# Altium schematic sheet Sheet1.SchDoc: Мобильное устройство обмена
size 420 x 297 mm; CheckedBy: Ролич; Author: Лёля; CompanyName: ПИКС, гр. 613802; Address1: Address1; Address2: Address2; Address3: Address3; Address4: Address4; DocumentNumber: ГУИР.465614.009 Э3; SheetNumber: 1; SheetTotal: 1; Scale: 1:1; Title2str: данными через Ethernet; DocumentType: Схема электрическая принципиальная; FirstReferrence: ГУИР.465614.009 Э3
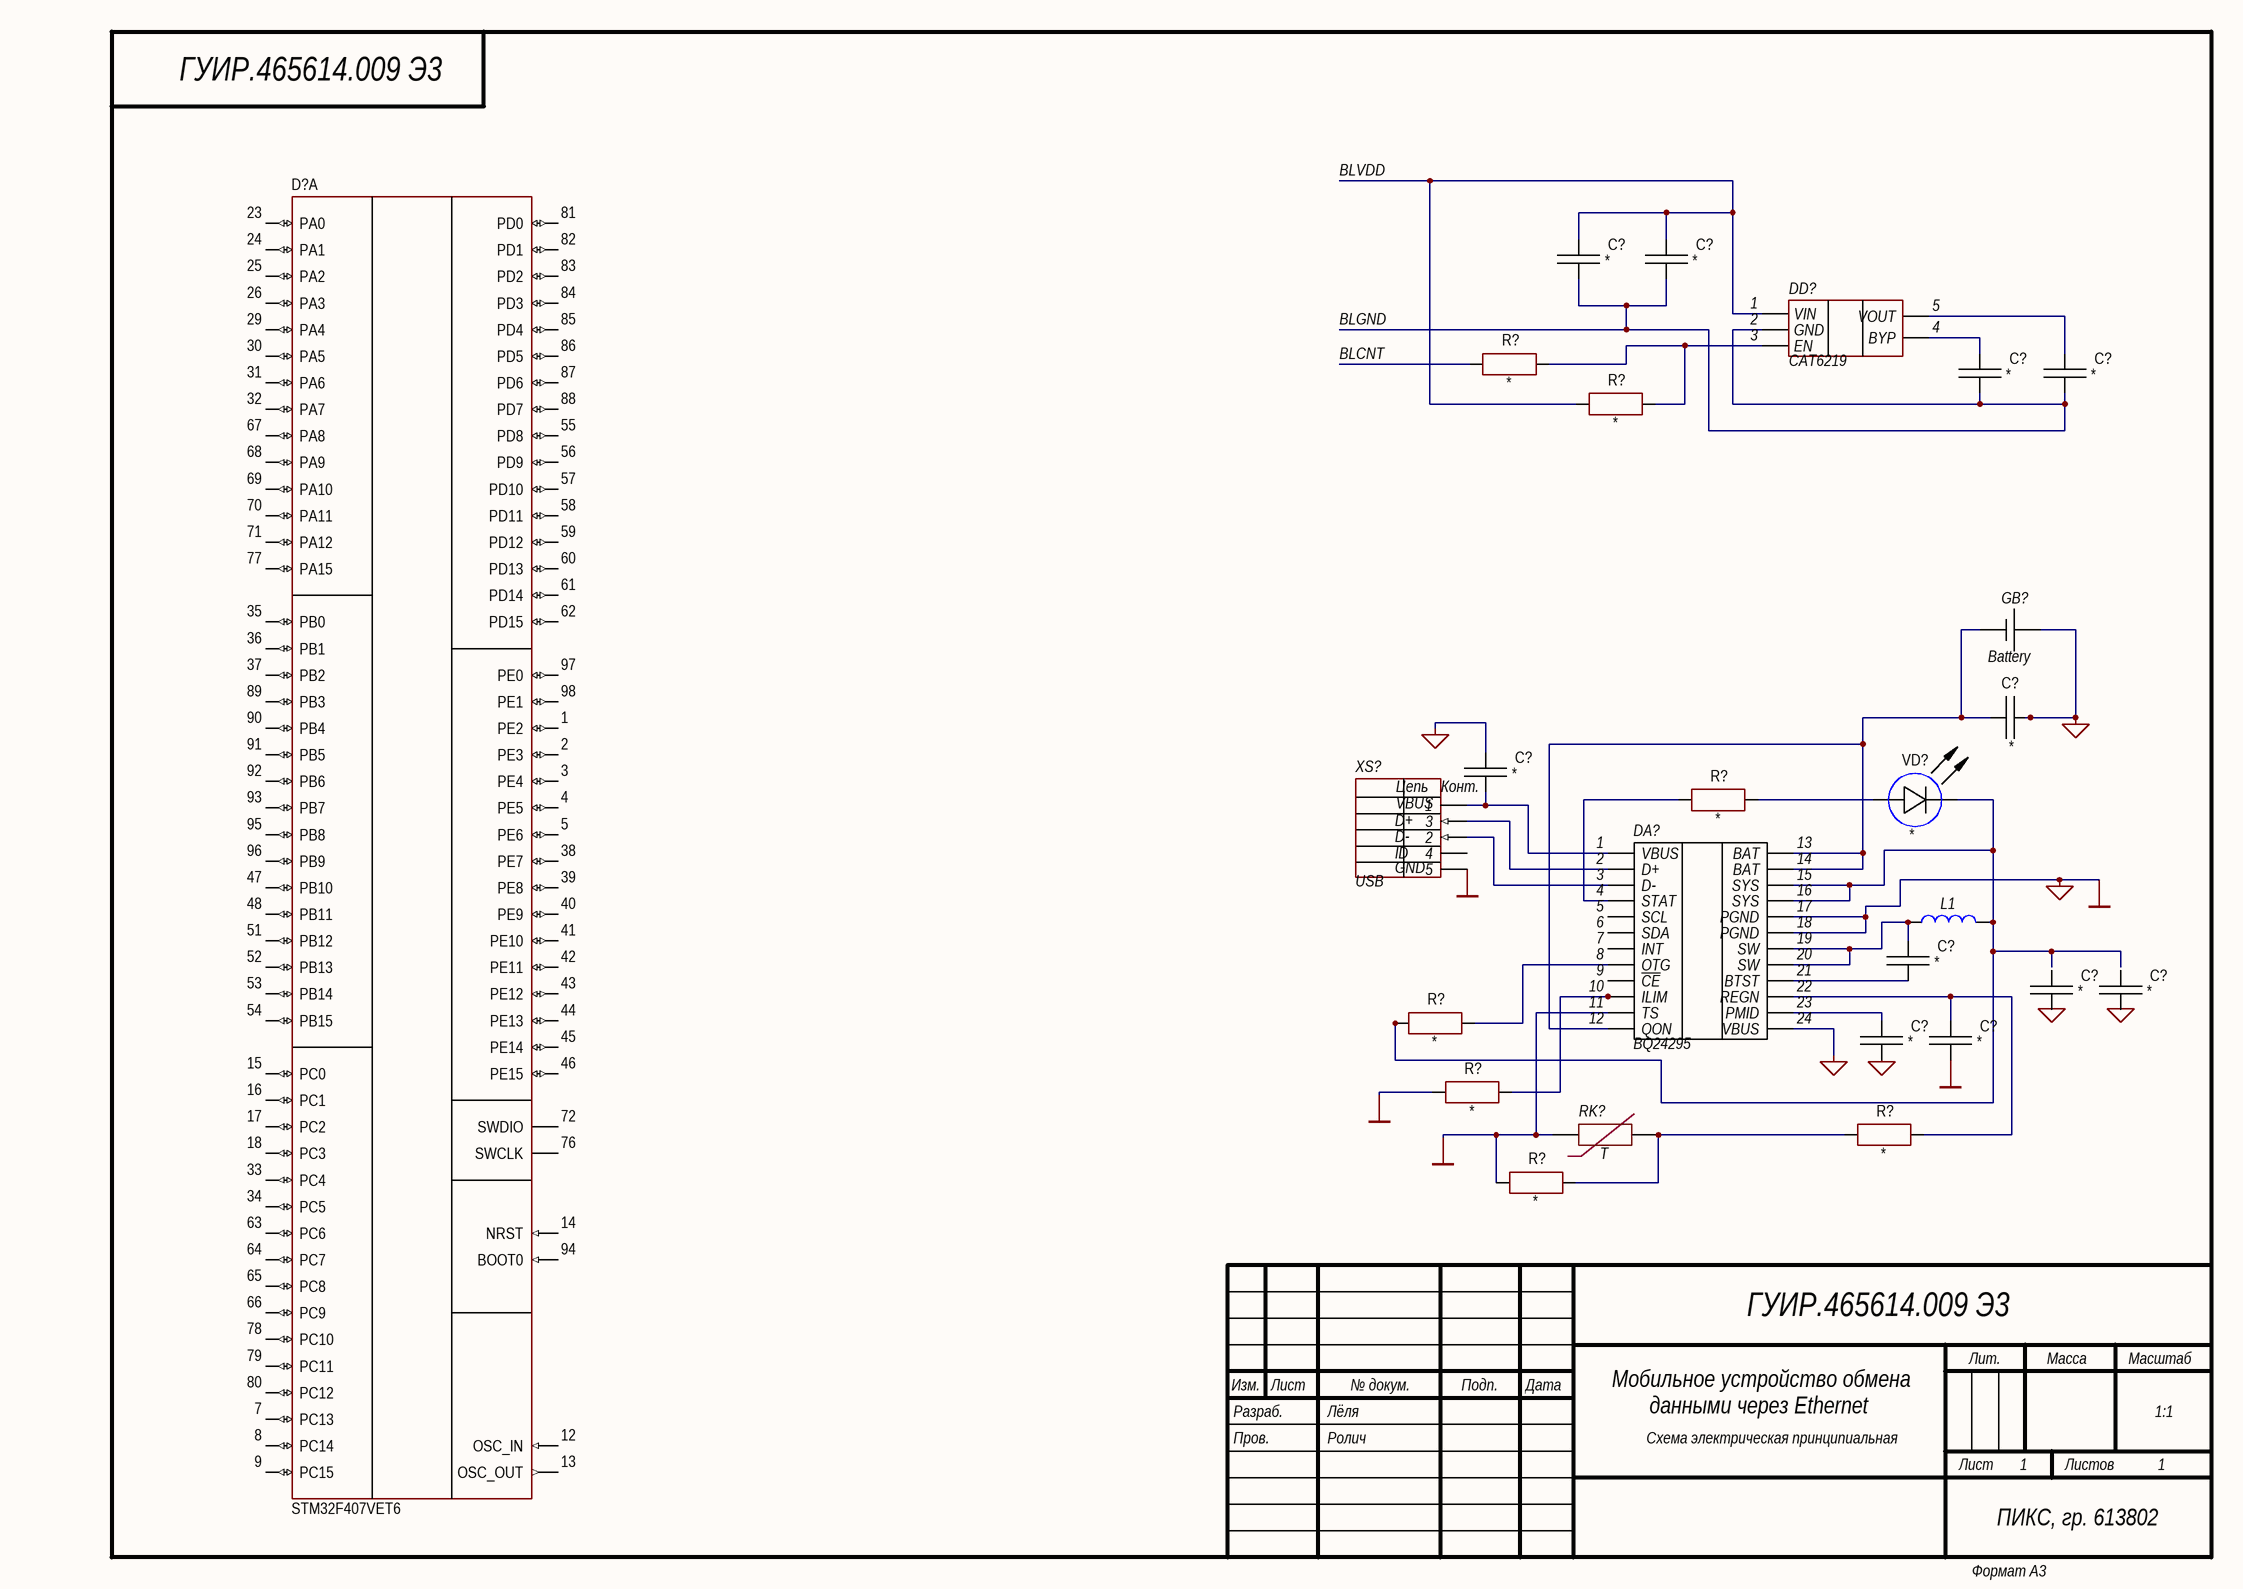
[diagram p0: Sheet1.SchDoc]

## Parts
(Parts that share a designator on the sheet are numbered #1, #2 ... from top to bottom, then left to right.)
C?#1  *  [CAP: DEBB33D]
C?#2  *  [CAP: DEBB33D]
C?#3  *  [CAP: DEBB33D]
C?#4  *  [CAP: DEBB33D]
C?#5  *  [CAP: DEBB33D]
C?#6  *  [CAP: DEBB33D]
C?#7  *  [CAP: DEBB33D]
C?#8  *  [CAP: DEBB33D]
C?#9  *  [CAP: DEBB33D]
C?#10  *  [CAP: DEBB33D]
C?#11  *  [CAP: DEBB33D]
D?  STM32F407VET6  [LQFP100_No Pad]  (part A of 2)
DA?  BQ24295  [BQ24295]
DD?  CAT6219  [CAT6219]
GB?  Battery  [Battery]
L1  Inductor  [0402-A]  (value not drawn)
R?#1  *  [CH0201R]
R?#2  *  [CH0201R]
R?#3  *  [CH0201R]
R?#4  *  [CH0201R]
R?#5  *  [CH0201R]
R?#6  *  [CH0201R]
R?#7  *  [CH0201R]
RK?  Resistor_termo  [RC_0805 (Resistor)]  (value not drawn)
VD?  *  [CH0603LB]
XS?  USB  [USB]

## Nets
GND: C?#5.2 C?#6.1 C?#11.2 DA?.11(TS) DA?.17(PGND) DA?.18(PGND) GB?.2 R?#5.1 R?#7.1 RK?.1 XS?.5  [also labelled VCC]
SGND: DA?.24(VBUS)
BLCNT: R?#1.1
BLGND: C?#1.2 C?#2.2 C?#3.2 C?#4.2 DD?.2(GND)
BLVDD: C?#1.1 C?#2.1 DD?.1(VIN) R?#2.1
NetC?#3_1: C?#3.1 DD?.4(BYP)
NetC?#4_1: C?#4.1 DD?.5(VOUT)
NetC?#5_1: C?#5.1 DA?.12(QON) DA?.13(BAT) DA?.14(BAT) GB?.1
NetC?#6_2: C?#6.2 DA?.1(VBUS) XS?.1
NetC?#7_1: C?#7.1 DA?.19(SW) DA?.20(SW) L1.1
NetC?#7_2: C?#7.2 DA?.21(BTST)
NetC?#10_1: C?#10.1 DA?.23(PMID)
NetC?#11_1: C?#11.1 DA?.22(REGN) R?#6.2
NetDA?_2: DA?.2(D+) XS?.3
NetDA?_3: DA?.3(D-) XS?.2
NetDA?_4: DA?.4(STAT) R?#3.1
NetDA?_8: DA?.8(OTG) R?#4.2
NetDA?_10: DA?.10(ILIM) R?#5.2
NetDA?_15: DA?.15(SYS) DA?.16(SYS) L1.2 R?#4.1 VD?.2(C)
NetDD?_3: DD?.3(EN) R?#1.2 R?#2.2
NetR?#3_2: R?#3.2 VD?.1(A)
NetR?#6_1: R?#6.1 R?#7.2 RK?.2

Not connected (* = marked no-connect by the designer): C?#8 1 2; C?#9 1 2; C?#10 2; D? 1(PE2) 2(PE3) 3(PE4) 4(PE5) 5(PE6) 7(PC13) 8(PC14) 9(PC15) 12(OSC_IN) 13(OSC_OUT) 14(NRST) 15(PC0) 16(PC1) 17(PC2) 18(PC3) 23(PA0) 24(PA1) 25(PA2) 26(PA3) 29(PA4) 30(PA5) 31(PA6) 32(PA7) 33(PC4) 34(PC5) 35(PB0) 36(PB1) 37(PB2) 38(PE7) 39(PE8) 40(PE9) 41(PE10) 42(PE11) 43(PE12) 44(PE13) 45(PE14) 46(PE15) 47(PB10) 48(PB11) 51(PB12) 52(PB13) 53(PB14) 54(PB15) 55(PD8) 56(PD9) 57(PD10) 58(PD11) 59(PD12) 60(PD13) 61(PD14) 62(PD15) 63(PC6) 64(PC7) 65(PC8) 66(PC9) 67(PA8) 68(PA9) 69(PA10) 70(PA11) 71(PA12) 72(SWDIO) 76(SWCLK) 77(PA15) 78(PC10) 79(PC11) 80(PC12) 81(PD0) 82(PD1) 83(PD2) 84(PD3) 85(PD4) 86(PD5) 87(PD6) 88(PD7) 89(PB3) 90(PB4) 91(PB5) 92(PB6) 93(PB7) 94(BOOT0) 95(PB8) 96(PB9) 97(PE0) 98(PE1); DA? 5(SCL) 6(SDA) 7(INT) 9(~{CE}); XS? 4

## Notes on the sheet
- Labels drawn without touching a wire or pin: VCC
- Разраб.
- Изм.
- Лист
- № докум.
- Подп.
- Дата
- Лит.
- Масса
- Масштаб
- Пров.
- Листов
- Формат А3
- (in symbol Resistor_termo) T
- (in symbol USB) Цепь; Конт.; VBUS; D+; D-; ID; GND

## Library data of the parts
C?#1-C?#11 = Capacitor: Manufacturer: *; Model: *; HelpURL: *; ComponentKind: *; Value: *
D? = STM32F407VET6: Cortex-M4; Manufacturer: STMicroelectronics; Model: STM32F407VET6; HelpURL: https://www.digikey.com/product-detail/en/stmicroelectronics/STM32F407VET6/497-12075-ND/2793093; ComponentKind: 100-LQFP
DA? = BQ24295: PWR
L1 = Inductor: Code_IEC: 1005; Value: 10mH; Published: 8-Jun-2000; LatestRevisionDate: 29-May-2009; LatestRevisionNote: IPC-7351 Footprint Added.; PackageReference: 0402-A; Publisher: Altium Limited; PackageDescription: Chip Inductor; Code_JEITA: 0402
R?#1-R?#7 = Resistor: Manufacturer: *; Model: *; HelpURL: *; ComponentKind: *; Value: *
VD? = LED: Manufacturer: *; Model: *; HelpURL: *; ComponentKind: *; Value: *